# Altium schematic sheet PCB_Project.SchDoc
size A4; SheetNumber: 1; SheetTotal: 1
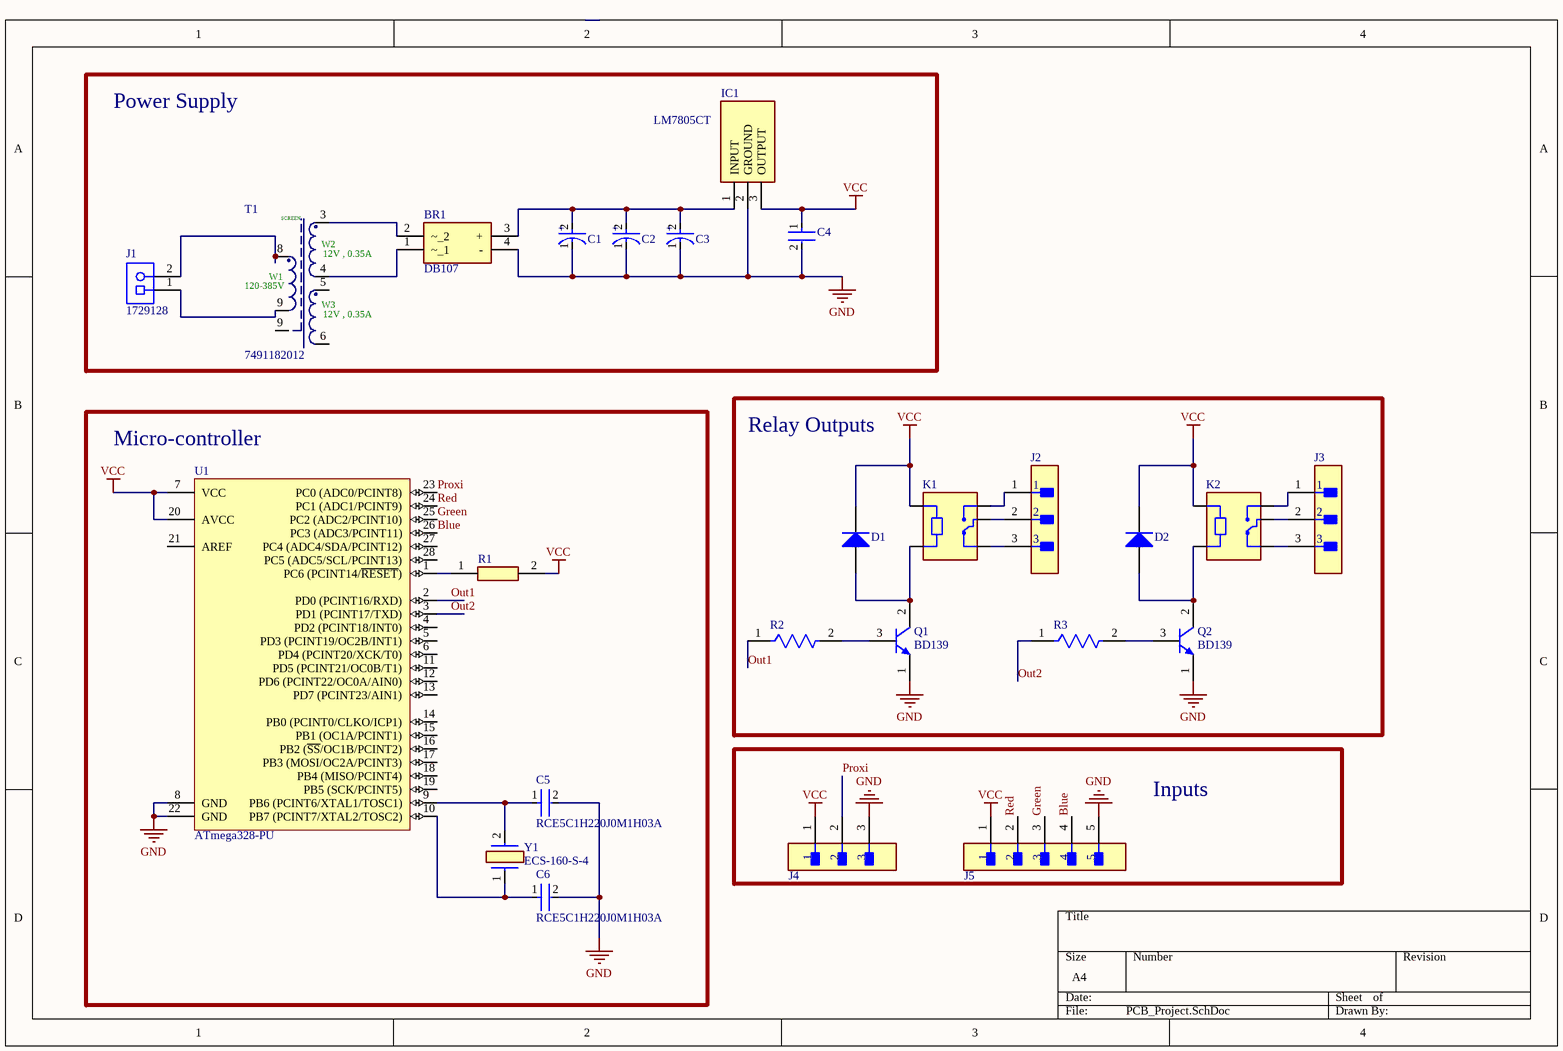
[diagram p0: PCB_Project.SchDoc]

## Parts
BR1  DB107  [DIP825W50P510L830H340Q4N]
C1  EEUTA1E101  [FP-RAD-TH-D_8_0_5-L_11_5-MFG]  (value not drawn)
C2  ECA2CHG470B  [FP-RAD-TH-D_12_5_0_5-L_20-MFG]  (value not drawn)
C3  ECA2AM100  [FP-RAD-TH-D_5_0_5-L_11_1-MFG]  (value not drawn)
C4  RCER72A104K1K1H03B  [FP-RCE1K1-2_5-MFG]  (value not drawn)
C5  RCE5C1H220J0M1H03A  [FP-RCE0K1-MFG]
C6  RCE5C1H220J0M1H03A  [FP-RCE0K1-MFG]
D1  1N4001-T  [DIOD-DO-41-P-2_V]  (value not drawn)
D2  1N4001-T  [DIOD-DO-41-P-2_V]  (value not drawn)
IC1  LM7805CT  [TO254P470X1028X1955-3P]
J1  1729128  [PHOE-1729128-2_V]
J2  B3B-XH-A(LF)(SN)  [FP-B3B-XH-A_LF_SN-MFG]  (value not drawn)
J3  B3B-XH-A(LF)(SN)  [FP-B3B-XH-A_LF_SN-MFG]  (value not drawn)
J4  B3B-XH-A(LF)(SN)  [FP-B3B-XH-A_LF_SN-MFG]  (value not drawn)
J5  B5B-EH-A(LF)(SN)  [FP-B5B-EH-A_LF_SN-MFG]  (value not drawn)
K1  SRD-05VDC-SL-C  [RELAY_SRD-05VDC-SL-C]  (value not drawn)
K2  SRD-05VDC-SL-C  [RELAY_SRD-05VDC-SL-C]  (value not drawn)
Q1  BD139  [ONSC-TO-225-3-77-09]
Q2  BD139  [ONSC-TO-225-3-77-09]
R1  PR02000201001JR500  [RESAD2760W63L1200D390]  (value not drawn)
R2  MFR-25FBF52-1K18  [FP-MFR-25-MFG]  (value not drawn)
R3  MFR-25FBF52-1K18  [FP-MFR-25-MFG]  (value not drawn)
T1  7491182012  [EE16_7_4 (E16)]
U1  ATmega328-PU  [28P3]
Y1  ECS-160-S-4  [ECS160S4]

## Blocks framed on the sheet
Power Supply: BR1 C1-C4 IC1 J1 T1
Micro-controller: C5 C6 R1 U1 Y1
Relay Outputs: D1 D2 J2 J3 K1 K2 Q1 Q2 R2 R3
Inputs: J4 J5

## Nets
GND: BR1.4(-) C1.1(C) C2.1(C) C3.1(C) C4.2 C5.2 C6.2 IC1.2(GROUND) J4.3 J5.5 Q1.1(E) Q2.1(E) U1.8(GND) U1.22(GND)
VCC: C4.1 D1.2(K) D2.2(K) IC1.3(OUTPUT) J4.1 J5.1 K1.A1 K2.A1 R1.2 U1.7(VCC) U1.20(AVCC)
Blue: J5.4 U1.26(PC3_(ADC3/PCINT11))
Green: J5.3 U1.25(PC2_(ADC2/PCINT10))
Out1: R2.1 U1.2(PD0_(PCINT16/RXD))
Out2: R3.1 U1.3(PD1_(PCINT17/TXD))
Proxi: J4.2 U1.23(PC0_(ADC0/PCINT8))
Red: J5.2 U1.24(PC1_(ADC1/PCINT9))
NetBR1_1: BR1.1(~_1) T1.4
NetBR1_2: BR1.2(~_2) T1.3
NetBR1_3: BR1.3(+) C1.2(A) C2.2(A) C3.2(A) IC1.1(INPUT)
NetC5_1: C5.1 U1.9(PB6_(PCINT6/XTAL1/TOSC1)) Y1.2
NetC6_1: C6.1 U1.10(PB7_(PCINT7/XTAL2/TOSC2)) Y1.1
NetD1_1: D1.1(A) K1.A2 Q1.2(C)
NetD2_1: D2.1(A) K2.A2 Q2.2(C)
NetJ1_1: J1.1 T1.9
NetJ1_2: J1.2 T1.8
NetJ2_1: J2.1 K1.NO
NetJ2_2: J2.2 K1.COM
NetJ2_3: J2.3 K1.NC
NetJ3_1: J3.1 K2.NO
NetJ3_2: J3.2 K2.COM
NetJ3_3: J3.3 K2.NC
NetQ1_3: Q1.3(B) R2.2
NetQ2_3: Q2.3(B) R3.2
NetR1_1: R1.1 U1.1(PC6_(PCINT14/~{RESET}))

Not connected (* = marked no-connect by the designer): T1 5 6; U1 4(PD2_(PCINT18/INT0)) 5(PD3_(PCINT19/OC2B/INT1)) 6(PD4_(PCINT20/XCK/T0)) 11(PD5_(PCINT21/OC0B/T1)) 12(PD6_(PCINT22/OC0A/AIN0)) 13(PD7_(PCINT23/AIN1)) 14(PB0_(PCINT0/CLKO/ICP1)) 15(PB1_(OC1A/PCINT1)) 16(PB2_(~{SS}/OC1B/PCINT2)) 17(PB3_(MOSI/OC2A/PCINT3)) 18(PB4_(MISO/PCINT4)) 19(PB5_(SCK/PCINT5)) 21(AREF) 27(PC4_(ADC4/SDA/PCINT12)) 28(PC5_(ADC5/SCL/PCINT13))

## Notes on the sheet
- (in symbol CMP-1471-00001-1) SCREEN; W2; 12V , 0.35A; W1; 120-385V; W3
- (in symbol CMP-05427-000869-1) +
- (in symbol CMP-05427-001477-1) +
- (in symbol CMP-05427-002094-1) +

## Library data of the parts
BR1 = DB107: Bridge Rectifier; Manufacturer_Name: Rectron; Datasheet Link: https://www.rectron.com/data_sheets/db101-107.pdf; Height: 3.4mm; Manufacturer_Part_Number: DB107; Mouser Part Number: 583-DB107; Mouser Price/Stock: https://www.mouser.co.uk/ProductDetail/Rectron/DB107?qs=G5AQjGfRJcLGAY%252B6bEDnbw%3D%3D
C1 = CMP-05427-002094-1: Aluminum Electrolytic Capacitors (Radial Lead Type) AEC-Q200 Qualified 100uF ±20% 25V; Dielectric Material: Aluminium; Lead Length: 17mm; ESR (Equivalent Series Resistance): 130mR; Ripple Current: 500mA; Polarity: Polar; Life (Hours): 2000Hour; Lead Diameter: 0.6mm; Leakage Current: 25uA; Length: 11.5mm; Voltage: 25V; Mount: Through Hole; Number of Pins: 2; Packaging: Bulk; Tolerance: 20%; RoHS Compliant: Yes; Lead Pitch: 3.5mm; Radiation Hardening: No; Height - Seated (Max): 0.492inch; Height: 11.5mm; Max Operating Temperature: 125°C; Voltage Rating: 25V; Package Quantity: 200; Contact Plating: Tin; Series: TA; Impedance: 130mR; Termination: Radial; Case/Package: Radial; Diameter: 8mm; Voltage Rating (DC): 25V; Capacitance: 100uF; Min Operating Temperature: -40°C; Construction: RADIAL
C2 = CMP-05427-001477-1: Aluminum Electrolytic Capacitors (Radial Lead Type) 47uF ±20% 160V; Lead Diameter: 0.6mm; Lead/Base Style: Straight; Life (Hours): 2000Hour; Ripple Current: 220mA; Height - Seated (Max): 0.866inch; Diameter: 12.5mm; Package Quantity: 500; Packaging: Ammo Pack; Lead Pitch: 5mm; Series: NHG; Width: 12.5mm; Height: 20mm; Case/Package: Radial; Radiation Hardening: No; Termination: Radial; Capacitance: 47uF; Min Operating Temperature: -25°C; Voltage Rating: 160V; RoHS Compliant: Yes; Max Operating Temperature: 105°C; Voltage Rating (DC): 160V; Length: 20mm; Tolerance: 20%; Mount: Through Hole
C3 = CMP-05427-000869-1: Aluminum Electrolytic Capacitors (Radial Lead Type) 10uF ±20% 100V; Polarity: Polar; Lead Diameter: 0.5mm; Dissipation Factor: 0.1%; Leakage Current: 3uA; Dielectric Material: Aluminium; Ripple Current: 70mA; Life (Hours): 2000Hour; Lead/Base Style: Straight; Length: 11mm; Case/Package: Radial; Lead Pitch: 2mm; Contact Plating: Tin; RoHS Compliant: Yes; Radiation Hardening: No; Capacitance: 10uF; Max Operating Temperature: 85°C; Lead Free: Lead Free; Termination: Radial; Voltage Rating: 100V; Package Quantity: 200; Voltage: 100V; Construction: RADIAL; Height: 11mm; Min Operating Temperature: -40°C; Diameter: 5mm; REACH SVHC: No SVHC; Tolerance: 20%; Width: 5mm; Height - Seated (Max): 0.472inch; Mount: Through Hole; Series: M; Voltage Rating (DC): 100V; Packaging: Bulk; Ripple Current (AC): 70mA; Number of Pins: 2
C4 = CMP-06035-011084-1: Cap Ceramic Monolithic 100nF 100V 10% Thru-Hole Bulk; Dielectric: X7R; Lead/Base Style: Formed Leads; Lead Diameter: 0.5mm; Resistor Type: Ceramic; Voltage Rating: 100V; Case/Package: Radial; Packaging: Bulk; Capacitance: 100nF; Lead Pitch: 0.197inch; Height - Seated (Max): 0.138inch; Voltage Rating (DC): 100V; Mount: Through Hole; Height: 3.5mm; Width: 0.098inch; Termination: Radial; Tolerance: 10%; Min Operating Temperature: -55°C; Package Quantity: 500; Max Operating Temperature: 125°C; Length: 0.157inch; Ratings: AEC-Q200
C5 C6 = CMP-06035-004895-1: Cap Ceramic 22pF 50V C0G ±5% Radial 5mm +125°C Automotive Bulk; Lead/Base Style: Formed Leads; Lead Diameter: 0.5mm; Max Operating Temperature: 125°C; Termination: Radial; Package Quantity: 2000; Capacitance: 22pF; Dielectric: C0G; Height - Seated (Max): 0.138inch; Width: 0.098inch; Lead Pitch: 0.197inch; Tolerance: 5%; Resistor Type: Ceramic; Case/Package: Radial; Mount: Through Hole; Voltage Rating: 50V; Ratings: AEC-Q200; Min Operating Temperature: -55°C; Packaging: Tape and Reel; Voltage Rating (DC): 50V; Height: 3.5mm; Length: 0.142inch
D1 D2 = CMP-0639-00006-2: 1.0 A Rectifier, 15 pF, 50 V, -65 to 150 degC, 2-Pin DO-41 Plastic, RoHS, Tape and Reel; Manufacturer: Diodes Inc; VF (V): 1; CT (pF): 15; Max. IR (uA): 5; VRRM (V): 50; Max. IFSM (A): 30; RoHS: TRUE; Mounting Technology: Through Hole; PartNumber: 1N4001-T; ComponentLink2Description: Datasheet; DatasheetVersion: Rev. 8-2; Operating Temperature Range (degC): -65 to 150; Packing: Tape and Reel; PackageReference: DO-41-P-2; ComponentLink1URL: http://diodes.com/; PackageDescription: 2-Pin Axial Lead, Body 4.635 x 2.36 mm, Lead Spread 25.4 mm; ComponentLink2URL: http://diodes.com/datasheets/ds28002.pdf; Max. Average Rectified Current IO (A): 1; ComponentLink1Description: Manufacturer URL
IC1 = LM7805CT: Integrated Circuit; Manufacturer_Name: Texas Instruments; Datasheet Link: http://www.ti.com/lit/ds/symlink/lm340.pdf; Height: 4.7mm; Manufacturer_Part_Number: LM7805CT; Mouser Part Number: 926-LM7805CT; Mouser Price/Stock: https://www.mouser.co.uk/ProductDetail/Texas-Instruments/LM7805CT?qs=QbsRYf82W3EaqXeMDVwIfQ%3D%3D; Arrow Part Number: LM7805CT; Arrow Price/Stock: https://www.arrow.com/en/products/lm7805ct/texas-instruments?region=europe
J1 = CMP-2000-05815-1: PCB Terminal Block, 13.5 A, 400 V, 2-Pin THD, RoHS, Bulk; Manufacturer: Phoenix Contact; Package Version: 03/2015; No. of Rows: 1; Pitch: 5.08mm; No. of Positions: 2; Voltage Rating: 400V; Current Rating: 13500mA; Manufacturer URL: http://www.phoenixcontact.com/; Datasheet URL: https://datasheet.ciiva.com/16046/1729128-16046181.pdf; RoHS: TRUE; Package URL: https://www.phoenixcontact.com/online/portal/pi/pxc/product_detail_page/!ut/p/b1/3VdJjqNKFDxLH8AFycySyWY2ozFsEPOMMQaDOX1XedGL_1Vdm5YXJleknhSKeBkvI6EA8ncAo3AYoDhBQGco6KN7VURTdemj9us_IEKEZo_YHiPAEWEFmDGOHMORkqKYCORBZxgL7ZoaZYcbFFUZ3fqxSY6GOuxydWUuHqz1ynmMFygu583Bob0Ewr6Sd_l-5m-kAueHiB0jpRwZwe58wwtkpxtMYd_LmGcDRU02dRNEyWt6Y2ti5pSyJ_reIkzIulrqApdnbT11V5jnCKbYNCvhEM1MCpPByat_X379-iThf08CI5GfOPqfBeS3BRoBOdD55AKVv0iLwCMq-2BrzXWSGRH7pUGD9uwXQjiph3xL0DKQwdGa0JImiIOmBNOestqgwTHSSs2oOep-78apyXQBvNi8ZLaFjvjWvcaUEBu0MC6Wbe-d6mB0FAebo2lUWinqYaZs5DAYzV0RP9yitUjnGJ0iI9xhZkT42OCQNUJJhkgWINNQLP2JFP6OpMg3JCVg70jqHT0lvKOnhHf0lPuOnnLf0VPuWx6_dxwUIvwk5WMkT0kLL1mh61l2yZVSzG3pYV_bqo-mj6uMKwKwdnnW8Jh5RTOJzMOA5c-eJDaZQw4mTMPH02PvS_ZAqNVjVTo2WyYLkwH_KU1mmmG5kjRhDqPXLwwVHvVOjCM60-fpXvTDfMGW1PVFVS1r4e4yVDk4ZdNbkUHvqPqQSeian4UD39fNKmachqdJ1NJbyk8rXT9mXTvPk3oE5meulKGgiruPJek-4I9hTT6G8ZLOyRSm2RRVbThERQad5OS28hdt4YW4vG0stgYYzsWsK4_7y6DZMjJSCqri1kyiZR5vD7pwIrNR7QwPHTcLTI5qT7eRlpHrdGiupYlqQDJ7zy_CND8fWWBoLRXxk1RVcXiBQwbTD4Xi7KL-FuO94t9xaqweXzH; PartNumber: 1729128; Package Description: 2-Pin Through Hole Device, Body 8.1 x 10.16 mm, Pitch 5.08 mm; Datasheet Version: 12/2013; Mounting Technology: ThroughHole; Orientation: Horizontal; Package Reference: 1729128-2; Packing: Bulk
J2-J4 = CMP-17439-000014-3: CONN HEADER VERT 3POS 2.5MM; Max Voltage Rating (DC): 250V; Number of Positions: 3; Current Rating: 3A; Gender: Male; Wire/Cable Gauge: 22AWG; Contact Resistance: 20mR; Insulation Resistance: 1GR; Insulation Material: Nylon; Contact Plating: Tin; Depth: 5.75mm; Contact Type: Male Pin; Max Operating Temperature: 85°C; Insulation Color: Natural; Voltage Rating (AC): 250V; Color: Natural; Connector Type: Header; Orientation: Straight; Fastening Type: Detent; Housing Color: White; Min Operating Temperature: -25°C; Termination: Solder; Voltage Rating: 250V; Series: XH; Pitch: 2.5mm; Contact Shape: Square; Number of Rows: 1; Lead Free: Lead Free; Packaging: Bulk; Mount: Through Hole; Flammability Rating: UL94 V-0; Max Voltage Rating (AC): 250V; REACH SVHC: No SVHC; Housing Material: Polyamide; Contact Material: Brass; Lead Pitch: 2.5mm; Contact Finish - Mating: TIN; Length: 9.9mm; Max Current Rating: 3A; Number of Contacts: 3
J5 = CMP-17439-000382-1: CONN HEADER VERT 5POS 2.5MM; Number of Contacts: 5; Mated Stacking Heights: 8.1mm; Current Rating: 3A; Gender: Male; Voltage Rating: 250V; Lead Free: Lead Free; Fastening Type: Friction; Contact Type: Male Pin; Insulation Color: Natural; Insulation Material: Nylon; Contact Material: Brass; Contact Mating Length: 0.13inch; Pitch: 2.5mm; Number of Positions: 5; Number of Rows: 1; Connector Type: Header; Color: Natural; Contact Shape: Square; Flammability Rating: UL94 V-0; Orientation: Straight; Packaging: Bulk; Mount: Through Hole; Contact Finish - Mating: TIN; Contact Plating: Tin; Series: EH; Termination: Solder; Housing Color: White
K1 K2 = SRD-05VDC-SL-C: 5V Trigger Relay Module For Arduino And Raspberry Pi 5V Trigger Relay Module For Arduino And Raspberry Pi; MF: Songle Relay; Check_prices: https://www.snapeda.com/parts/SRD-05VDC-SL-C/Songle+Relay/view-part/?ref=eda; Value: *; Availability: Not in stock; Price: None; Package: NON STANDARD-5 Songle Relay; MP: SRD-05VDC-SL-C; SnapEDA_Link: https://www.snapeda.com/parts/SRD-05VDC-SL-C/Songle+Relay/view-part/?ref=snap
Q1 Q2 = CMP-1048-01271-1: Plastic Medium-Power Silicon NPN Transistor, 3-Pin TO-225, Bulk Box; Manufacturer: On Semiconductor; IC Continuous (A): 1.5; Packing: Bulk Box; ComponentLink2URL: http://www.onsemi.com/pub_link/Collateral/BD135-D.PDF; ComponentLink2Description: Datasheet; ComponentLink1URL: http://www.onsemi.com/; Polarity: NPN; PartNumber: BD139; ComponentLink1Description: Manufacturer URL; RoHS: FALSE; ComponentLink3Description: Package Specification; PackageReference: TO-225-3-77-09; Mounting Technology: Through Hole; DatasheetVersion: Rev. 16; PackageDescription: 3-Pin Flange Mount, Vertical Straight Lead, Body 7.6 x 2.7 mm, Pitch 2.29 mm; PackageVersion: Rev. AC, 12/2013; ComponentLink3URL: http://www.onsemi.com/pub_link/Collateral/77-09.PDF
R1 = PR02000201001JR500: Resistor; Manufacturer_Name: Vishay; Datasheet Link: http://www.vishay.com/docs/28729/pr010203.pdf; Manufacturer_Part_Number: PR02000201001JR500; Mouser Part Number: 594-5083NW1K000J; Mouser Price/Stock: https://www.mouser.co.uk/ProductDetail/Vishay-BC-Components/PR02000201001JR500?qs=%252BZ426PJ3lGg9NbbN9v%2FwIg%3D%3D; Arrow Part Number: PR02000201001JR500; Arrow Price/Stock: https://www.arrow.com/en/products/pr02000201001jr500/vishay
R2 R3 = CMP-03413-000001-1: RES 1.18K OHM 1/4W 1% AXIAL; Manufacturer: Yageo; Value: 1.18kΩ; Temperature Coefficient: 100ppm/°C; Power Rating: 0.25W; Voltage Rating: 250V; Temperature: -55°C to +155°C; Automotive: No; Temperature Range High: +155°C; Mouser Description: Metal Film Resistors 1.18K OHM 1/4W 1%; Digikey Description: RES 1.18K OHM 1/4W 1% AXIAL; Lead Free: Yes; Tolerance: 1%; ComponentLink2Description: Datasheet; ComponentLink2URL: https://www.yageo.com/upload/media/product/products/datasheet/lr/Yageo_LR_MFR_1.pdf; Temperature Range Low: -55°C; Package: MFR-25; Ipc Land Pattern Name: RESAD1000W75L680D260; Composition: Metal Film; Category: Res; Octopart: https://octopart.com/mfr-25fbf52-1k18-yageo-56251681; Series: MFR; Device Class L2: Resistors; Height: 2.6mm; Resistance: 1.18kΩ; Device Class L3: Through-Hole Resistors; Manufacturer Part Number: MFR-25FBF52-1K18; RoHS: TRUE; Device Class L1: Passive Components
T1 = CMP-1471-00001-1: Off-Line Transformer WE-UNIT , L=0.9mH; Manufacturer: Wuerth Elektronik; Turns Ratio: "9.5","1:1"; Inductance: 0.9mH; Output Voltage (DC): 12; Output Current (A): 0.6; Input Voltage (AC): 85-265; ComponentLink1Description: Manufacturer URL; ComponentLink1URL: http://www.we-online.com; PackageReference: EE16_7_4 (E16); ComponentLink2Description: Datasheet; ComponentLink2URL: http://www.we-online.de/katalog/media/pdf/7491182012.pdf; PartNumber: 7491182012
U1 = CMP-0095-00015-2: 8-bit AVR Microcontroller, 32KB Flash, 1KB EEPROM, 2KB SRAM, 28-pin PDIP, Industrial Grade (-40°C to 85°C); ComponentLink3Description: ATmega48A/48PA/88A/88PA/168A/168PA/328/328P Summary; RevisionNote: DatasheetVersion updated. URLs added.; DatasheetVersion: revD, May-2011; ComponentLink1URL: http://www.atmel.com/; PackageVersion: revB, Sep-2001; PackageDescription: 28-lead (0.300"/7.62mm Wide) Plastic Dual Inline Package (PDIP); PackageReference: 28P3; ComponentLink1Description: Manufacturer URL; ComponentLink2Description: ATmega48A/48PA/88A/88PA/168A/168PA/328/328P Datasheet; ComponentLink3URL: http://www.atmel.com/dyn/resources/prod_documents/8271S.pdf; ComponentLink2URL: http://www.atmel.com/dyn/resources/prod_documents/8271.pdf
Y1 = ECS-160-S-4: Crystal or Oscillator; Manufacturer_Name: ECS; Datasheet Link: http://www.ecsxtal.com/store/pdf/hc_49us.pdf; Height: 3.5mm; Manufacturer_Part_Number: ECS-160-S-4; Mouser Part Number: 520-HCU1600-S; Mouser Price/Stock: https://www.mouser.co.uk/ProductDetail/ECS/ECS-160-S-4?qs=CNVyLAqdhH0J%2FZuif68kGw%3D%3D